# EAGLE design signal_board (EAGLE 6.2)
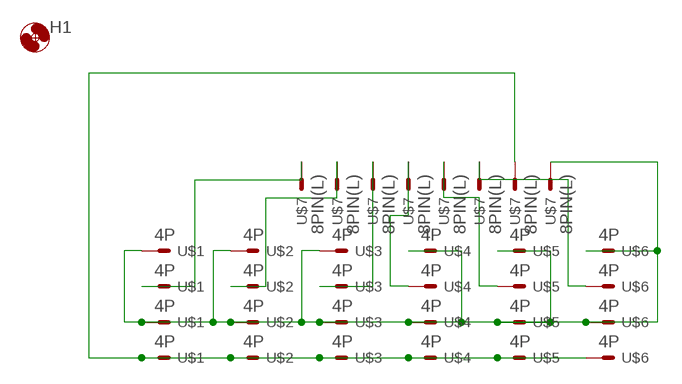
[diagram p0: schematic, sheet 1]

## Parts
H1  HOLE3.3M3BOLT  [HOLE3.3]
U$1  4P  [4P]
U$2  4P  [4P]
U$3  4P  [4P]
U$4  4P  [4P]
U$5  4P  [4P]
U$6  4P  [4P]
U$7  8PIN(L)  [8PL]

## Nets
5V: U$1.P2 U$1.P4 U$2.P2 U$2.P4 U$3.P2 U$3.P4 U$4.P2 U$4.P4 U$5.P2 U$5.P4 U$6.P2 U$6.P4 U$7.P8
GND: U$1.P1 U$2.P1 U$3.P1 U$4.P1 U$5.P1 U$6.P1 U$7.P7
N$3: U$5.P3 U$7.P5
N$4: U$1.P3 U$7.P1
N$5: U$2.P3 U$7.P2
N$6: U$3.P3 U$7.P3
N$7: U$4.P3 U$7.P4
N$8: U$6.P3 U$7.P6

## Library data of the parts
H1 = FP-21T for MITS:HOLE3.3
U$1-U$6 = my_connector:4P
U$7 = my_connector:8PIN(L)

## Board
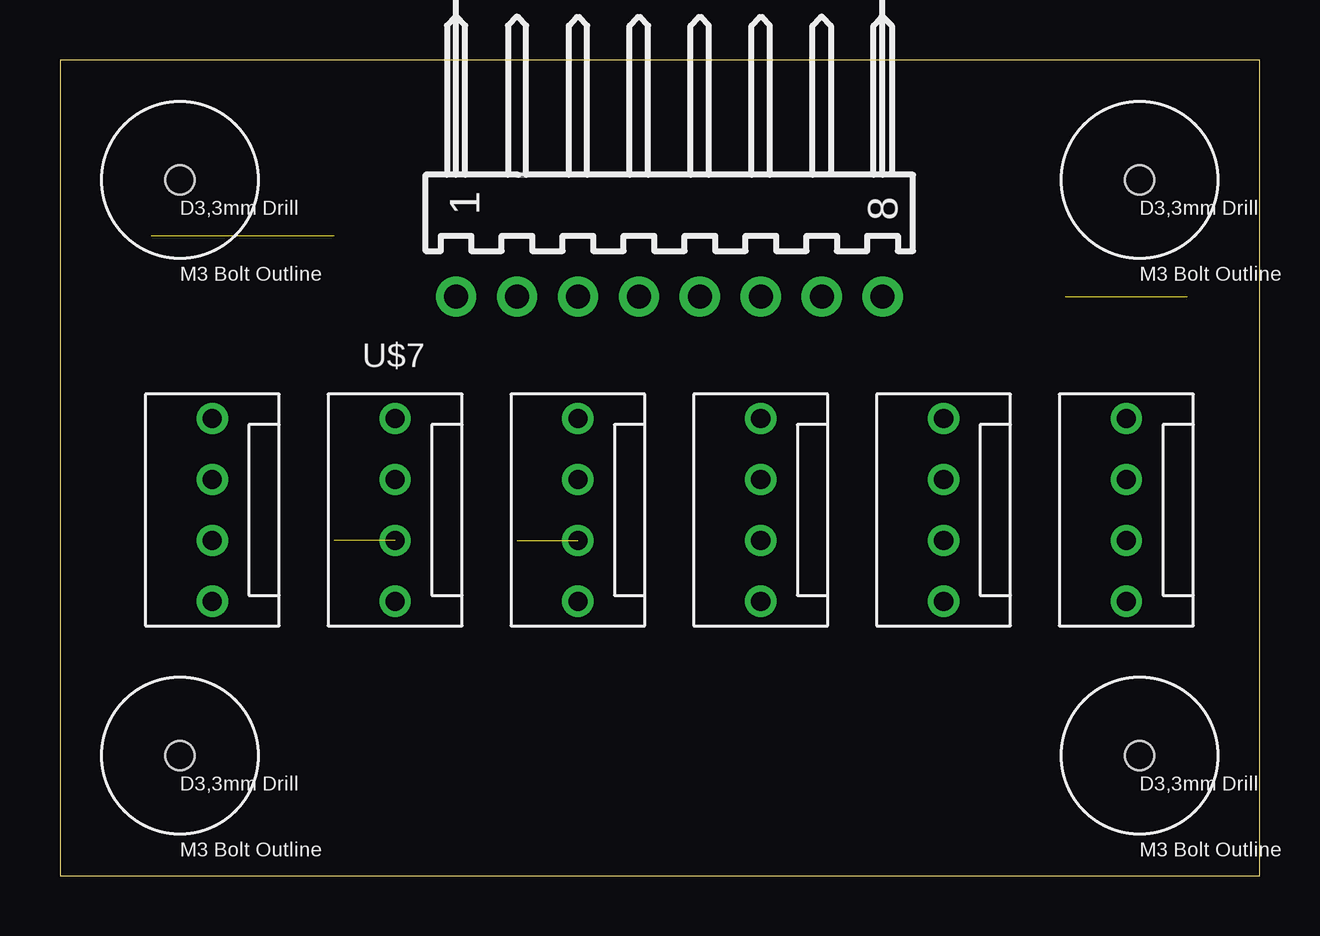
[diagram p1: board, top side]
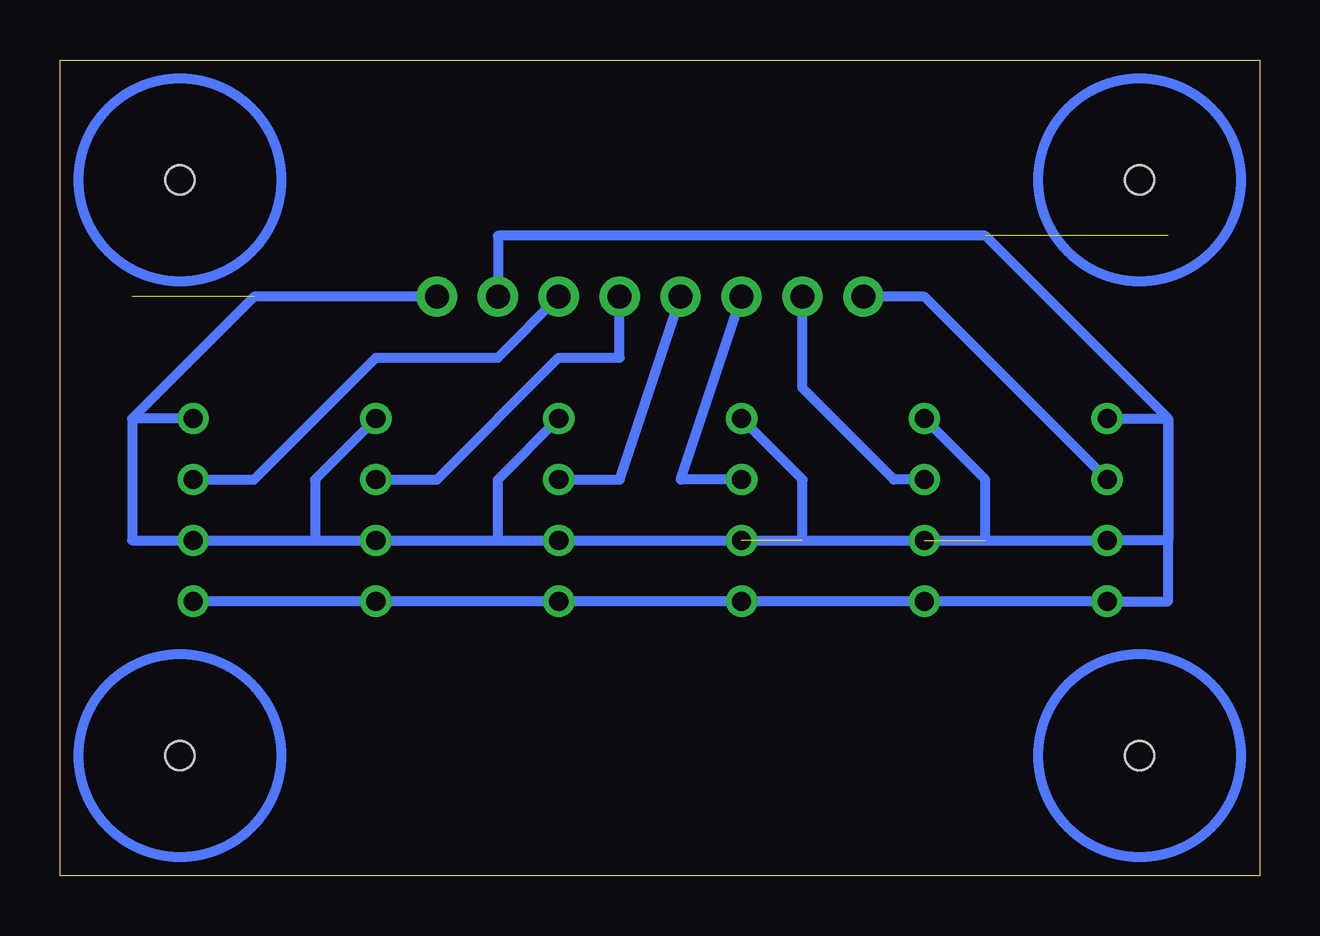
[diagram p2: board, bottom side, seen from below]

Size 50 x 34 mm. Coordinates in mm from the lower left corner, seen from the top.
Outline: 0,0 50,0 50,34 0,34 0,0
Copper layers (1*16): Top 0.035mm / dielectric 1.5mm / Bottom 0.035mm
Design rules: minimum track width 10mil, minimum drill 24mil, track to track 8mil, track to pad 8mil, pad to pad 8mil, via to via 8mil, smd to smd 8mil, copper to edge 40mil, drill to drill 8mil, minimum pad ring 10mil, minimum via ring 8mil, stop-mask expansion 4mil, vias tented up to drill 0mil, thermal gap 10mil

### Footprints (pad centres in the part's own frame; a part is rotated, then mirrored left to right if it is on the bottom)
HOLE3.3 = hole 1.2: 0,0
4P = drill 0.8: P1 3.81,0; P2 1.27,0; P3 -1.27,0; P4 -3.81,0
8PL = drill 1 pad 1.676: P1 -8.89,-3.81; P2 -6.35,-3.81; P3 -3.81,-3.81; P4 -1.27,-3.81; P5 1.27,-3.81; P6 3.81,-3.81; P7 6.35,-3.81; P8 8.89,-3.81

### Placement (x,y rotation side)
H1  5,5 0 top
H2  HOLE3.3M3BOLT  [HOLE3.3]  5,29 0 top
H3  HOLE3.3M3BOLT  [HOLE3.3]  45,29 0 top
H4  HOLE3.3M3BOLT  [HOLE3.3]  45,5 0 top
U$1  6.35,15.24 270 top
U$2  13.97,15.24 270 top
U$3  21.59,15.24 270 top
U$4  29.21,15.24 270 top
U$5  36.83,15.24 270 top
U$6  44.45,15.24 270 top
U$7  25.4,27.94 0 top

### Tracks (layer width: path | path; a pad name or v marks a point on that pad's centre or on a via)
5V  (3 unrouted)
  Bottom 0.406: 46.99,19.05 46.99,13.97 U$6.P2 39.37,13.97 | U$6.P4 46.99,19.05 | U$7.P8 41.91,24.13 46.99,19.05 | 39.37,13.97 U$5.P2 31.75,13.97 | 39.37,13.97 39.37,16.51 U$5.P4 | 31.75,13.97 U$4.P2 19.05,13.97 | 19.05,13.97 11.43,13.97 | 11.43,13.97 U$1.P2 3.81,13.97 3.81,19.05 U$1.P4 | 19.05,13.97 19.05,16.51 U$3.P4 | 31.75,13.97 31.75,16.51 U$4.P4 | 11.43,13.97 11.43,16.51 U$2.P4
GND  (1 unrouted)
  Bottom 0.406: U$6.P1 U$5.P1 U$4.P1 U$3.P1 U$2.P1 U$1.P1 3.81,11.43 3.81,19.05 11.43,26.67 31.75,26.67 U$7.P7
N$3
  Bottom 0.406: U$5.P3 34.29,16.51 29.21,21.59 26.67,21.59 U$7.P5
N$4
  Bottom 0.406: U$7.P1 13.97,24.13 U$1.P3
N$5
  Bottom 0.406: U$2.P3 15.24,16.51 19.05,20.32 U$7.P2
N$6
  Bottom 0.406: U$3.P3 24.13,16.51 U$7.P3
N$7
  Bottom 0.406: U$4.P3 26.67,16.51 U$7.P4
N$8
  Bottom 0.406: U$6.P3 41.91,16.51 36.83,21.59 31.75,21.59 U$7.P6
(copper drawn outside any net)
  shapes: Bottom circle x4